# Altium schematic sheet MainBoard.SchDoc
size A3; SheetNumber: 7; SheetTotal: 11
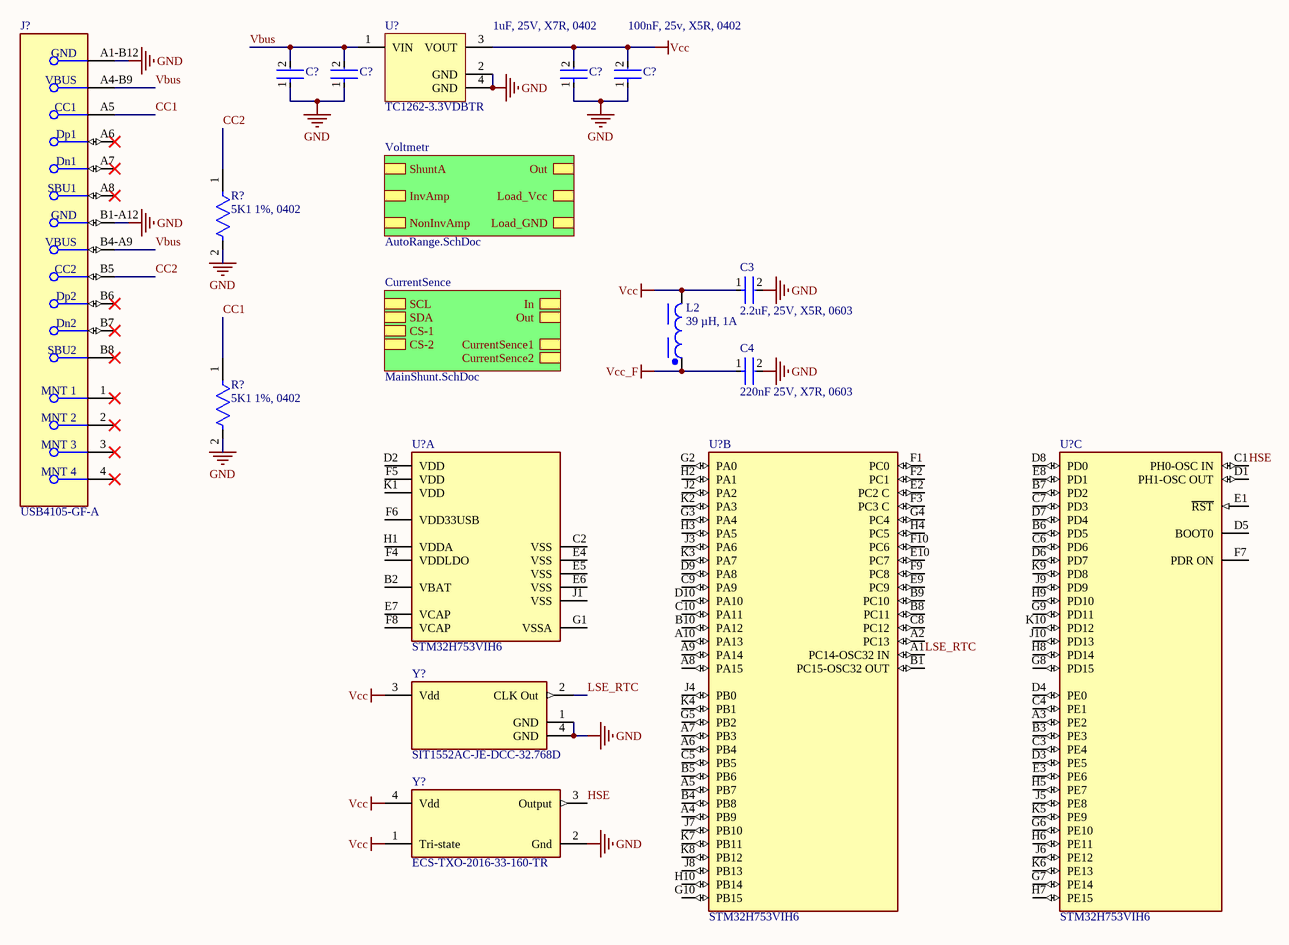
[diagram p0: MainBoard.SchDoc]

## Parts
(Parts that share a designator on the sheet are numbered #1, #2 ... from top to bottom, then left to right.)
C3  2.2uF, 25V, X5R, 0603  [FP-GRM188-0_1-e0_2_0_5-MFG]
C4  220nF 25V, X7R, 0603  [FP-GCM188-0_1-IPC_B]
C?#1  1uF, 25V, X7R, 0402  [FP-GRM155-0_05-IPC_B]  (value not drawn)
C?#2  100nF, 25v, X5R, 0402  [FP-GRM155-0_05-IPC_C]  (value not drawn)
C?#3  100nF, 25v, X5R, 0402  [FP-GRM155-0_05-IPC_C]  (value not drawn)
C?#4  1uF, 25V, X7R, 0402  [FP-GRM155-0_05-IPC_B]  (value not drawn)
J?  USB4105-GF-A  [FP-USB4105-GF-A-MFG]
L2  39 µH, 1A  [WE-PD_7345]
R?#1  5K1 1%, 0402  [FP-ERJ2RK-IPC_A]
R?#2  5K1 1%, 0402  [FP-ERJ2RK-IPC_A]
U?#1  TC1262-3.3VDBTR  [SOT-223-DB3_M]
U?#2  STM32H753VIH6  [FP-TFBGA100-A08Q-MFG]  (part A of 3)
U?#3  STM32H753VIH6  [FP-TFBGA100-A08Q-MFG]  (part B of 3)
U?#4  STM32H753VIH6  [FP-TFBGA100-A08Q-MFG]  (part C of 3)
Y?#1  SIT1552AC-JE-DCC-32.768D  [FP-SiT1552-J-MFG]
Y?#2  ECS-TXO-2016-33-160-TR  [FP-TXO-2016-MFG]

## Sub-sheets
CurrentSence = MainShunt.SchDoc: CurrentSence1, CurrentSence2, CS-1, CS-2, SDA, SCL, In, Out
Voltmetr = AutoRange.SchDoc: InvAmp, NonInvAmp, Load_GND, Load_Vcc, ShuntA, Out

## Nets
GND: C3.2 C4.2 C?#1.1 C?#2.1 C?#3.1 C?#4.1 J?.A1-B12(GND) J?.B1-A12(GND) R?#1.2 R?#2.2 U?#1.2(GND) U?#1.4(GND) Y?#1.1(GND) Y?#1.4(GND) Y?#2.2(Gnd)
Vcc: C3.1 C?#3.2 C?#4.2 L2.2 U?#1.3(VOUT) Y?#1.3(Vdd) Y?#2.1(Tri-state) Y?#2.4(Vdd)
Vcc_F: C4.1 L2.1
CC1: J?.A5(CC1) R?#2.1
CC2: J?.B5(CC2) R?#1.1
HSE: U?#4.C1(PH0-OSC_IN) Y?#2.3(Output)
LSE_RTC: U?#3.A1(PC14-OSC32_IN) Y?#1.2(CLK_Out)
Vbus: C?#1.2 C?#2.2 J?.A4-B9(VBUS) J?.B4-A9(VBUS) U?#1.1(VIN)

Not connected (* = marked no-connect by the designer): J? 1(MNT_1)* 2(MNT_2)* 3(MNT_3)* 4(MNT_4)* A6(Dp1)* A7(Dn1)* A8(SBU1)* B6(Dp2)* B7(Dn2)* B8(SBU2)*; U?#2 B2(VBAT) C2(VSS) D2(VDD) E4(VSS) E5(VSS) E6(VSS) E7(VCAP) F4(VDDLDO) F5(VDD) F6(VDD33USB) F8(VCAP) G1(VSSA) H1(VDDA) J1(VSS) K1(VDD); U?#3 A2(PC13) A4(PB9) A5(PB7) A6(PB4) A7(PB3) A8(PA15) A9(PA14) A10(PA13) B1(PC15-OSC32_OUT) B4(PB8) B5(PB6) B8(PC11) B9(PC10) B10(PA12) C5(PB5) C8(PC12) C9(PA9) C10(PA11) D9(PA8) D10(PA10) E2(PC2_C) E9(PC9) E10(PC7) F1(PC0) F2(PC1) F3(PC3_C) F9(PC8) F10(PC6) G2(PA0) G3(PA4) G4(PC4) G5(PB2) G10(PB15) H2(PA1) H3(PA5) H4(PC5) H10(PB14) J2(PA2) J3(PA6) J4(PB0) J7(PB10) J8(PB13) K2(PA3) K3(PA7) K4(PB1) K7(PB11) K8(PB12); U?#4 A3(PE2) B3(PE3) B6(PD5) B7(PD2) C3(PE4) C4(PE1) C6(PD6) C7(PD3) D1(PH1-OSC_OUT) D3(PE5) D4(PE0) D5(BOOT0) D6(PD7) D7(PD4) D8(PD0) E1(~{RST}) E3(PE6) E8(PD1) F7(PDR_ON) G6(PE10) G7(PE14) G8(PD15) G9(PD11) H5(PE7) H6(PE11) H7(PE15) H8(PD14) H9(PD10) J5(PE8) J6(PE12) J9(PD9) J10(PD13) K5(PE9) K6(PE13) K9(PD8) K10(PD12)

## Notes on the sheet
- 1uF, 25V, X7R, 0402
- (near C?#4) 100nF, 25v, X5R, 0402

## Library data of the parts
C3 = CMP-2006-02820-2: Chip Multilayer Ceramic Capacitors for General Purpose, 0603, 2.2uF, X5R, 15%, 10%, 25V; Number of Pins: 2; Dielectric: X5R; Tolerance: 10%; Case Code (Imperial): 0603; Thickness: 0.035inch; Case/Package: 0603; Lead Free: Lead Free; Mount: Surface Mount; Material: Ceramic; Depth: 0.8mm; Voltage: 25V; Capacitance: 2.2uF; Min Operating Temperature: -55°C; Package Quantity: 4000; REACH SVHC: No SVHC; Resistor Type: Ceramic; Packaging: Tape and Reel; Case Code (Metric): 1608; Max Operating Temperature: 85°C; Width: 0.8mm; Termination: SMD/SMT; Voltage Rating: 25V; Length: 1.6mm; Voltage Rating (DC): 25V; Height: 0.8mm; Radiation Hardening: No; Weight: 0.000222oz
C4 = CMP-2006-02366-2: Ceramic Capacitor for Automotive 220nF  ±10% 25VDC X7R 0603 Paper T/R; Capacitance: 220nF; Mount: Surface Mount; Ratings: AEC-Q200; Case/Package: 0603; Packaging: Tape and Reel; Radiation Hardening: No; Voltage: 25V; Dielectric: X7R; Case Code (Imperial): 0603; Max Operating Temperature: 125°C; Min Operating Temperature: -55°C; Depth: 0.8mm; Termination: SMD/SMT; Package Quantity: 1; Case Code (Metric): 1608; Thickness: 0.035inch; Voltage Rating: 25V; Tolerance: 10%; Voltage Rating (DC): 25V; Height: 0.8mm; Lead Free: Lead Free; Length: 1.6mm; Width: 0.031inch
C?#1 C?#4 = CMP-2008-04581-2: Chip Multilayer Ceramic Capacitors for General Purpose, 0402, 1.0uF, X5R, 15%, 10%, 25V; Height: 0.5mm; Voltage: 25V; Tolerance: 10%; Termination: SMD/SMT; Dielectric: X5R; REACH SVHC: No SVHC; Case Code (Imperial): 0402; Max Operating Temperature: 85°C; Lead Free: Lead Free; Case/Package: 0402; Mount: Surface Mount; Width: 0.5mm; Weight: 0.000212oz; Min Operating Temperature: -55°C; Voltage Rating (DC): 25V; Length: 1mm; Thickness: 0.022inch; Voltage Rating: 25V; Material: Ceramic; Case Code (Metric): 1005; Package Quantity: 10000; Packaging: Tape and Reel; Depth: 0.5mm; Capacitance: 1uF
C?#2 C?#3 = CMP-06035-003661-1: Chip Multilayer Ceramic Capacitors for General Purpose, 0402, 0.10uF, X7R, 15%, 10%, 25V; Length: 1mm; Depth: 0.5mm; Dielectric: X7R; Voltage Rating: 25V; Lead Free: Lead Free; Case Code (Imperial): 0402; Voltage: 25V; Min Operating Temperature: -55°C; Tolerance: 10%; Dielectric Material: Ceramic; Voltage Rating (DC): 25V; Max Operating Temperature: 125°C; Capacitance: 100nF; Thickness: 0.022inch; Case/Package: 0402; Height: 0.5mm; Resistor Type: Ceramic; Weight: 0.000212oz; Case Code (Metric): 1005; Package Quantity: 10000; Termination: SMD/SMT; Width: 0.02inch; Mount: Surface Mount; Packaging: Tape and Reel
J? = CMP-245163-000001-1: CONN RCPT USB2.0 TYPEC 5A; Manufacturer: GCT; Voltage Rating: 20V; Is Female: yes; Current Rating: 5/6.25/1.25/0.25A; Number Of Contacts: 16; Conn Orientation: Right Angle; Device Class L1: Connectors; Category: Conn; Lead Free: Yes; RoHS: TRUE; Temperature Range High: +85°C; Digikey Description: CONN RCPT USB2.0 TYPEC 5A; Device Class L3: unset; ComponentLink2Description: Datasheet; Manufacturer Part Number: USB4105-GF-A; Package: 0; Usb Standard: USB 2.0; Device Class L2: USB Connectors; Automotive: No; Temperature Range Low: -40°C; Height: 3.46mm; Temperature: -40°C to +85°C; Contact Material: Gold,Nickel; ComponentLink2URL: https://gct.co/files/drawings/usb4105.pdf; Octopart: https://octopart.com/usb4105-gf-a-gct-106627878
L2 = CMP-0227-00153-2: NexarPartId: 29930417; Max DC Current: 1.11A; Shielding: Shielded; Inductance: 39µH; Self Resonant Frequency: 11MHz; DC Resistance (DCR): 145mΩ; Tolerance: 20%; Ambient Temperature Range Low: -40°C; Width: 7.3mm; Length: 7.3mm; Number of Pins: 2; Packaging: Tape & Reel; Height: 4.5mm; Ambient Temperature Range High: 85°C; Max Operating Temperature: 125°C; Depth: 7.3mm; Min Operating Temperature: -40°C; RoHS: Compliant; Current Rating: 1.11A
R?#1 R?#2 = CMP-2002-01158-2: RES SMD 5.1K OHM 1% 1/10W 0402; Voltage Rating: 50V; Temperature Coefficient: 100ppm/°C; Resistance: 5.1kR; Power Rating: 100mW; Min Operating Temperature: -55°C; Technology: THICK FILM; Military Standard: Not; Depth: 0.5mm; Contact Plating: Tin; Tolerance: 1%; Construction: Rectangular; Length: 1mm; Case/Package: 0402; Lead Free: Lead Free; RoHS Compliant: Yes; Termination: SMD/SMT; Height: 0.35mm; Max Operating Temperature: 155°C; Case Code (Imperial): 0402; Number of Terminations: 2; Packaging: Tape and Reel; Case Code (Metric): 1005; Width: 0.5mm; Max Power Dissipation: 100mW; Package Quantity: 10000; Resistance Tolerance: 1%; REACH SVHC: No SVHC; Mount: Surface Mount; Series: ERJ; Voltage Rating (DC): 50V; Weight: 2.8E-05oz; Resistor Type: Thick Film
U?#1 = CMP-0136-00481-1: 500mA Fixed Output CMOS LDO, 3-Pin SOT-223, Extended Temperature, Tape and Reel; PackageVersion: revBB, Aug-2009; PackageDescription: 3-Lead Plastic Small Outline Transistor (DB) [SOT-223]; DatasheetVersion: revB, 2002; PackageReference: SOT-223-DB3
U?#2-U?#4 = CMP-12105-000002-1: HIGH-PERFORMANCE AND DSP WITH DP; Manufacturer: STMicroelectronics; Number Of Timers/Counters: 20; Min Supply Voltage: 1.71V; Standoff Height: 0.15mm; Number Of I/Os: 82; Data Bus Width: 32bits; Interface: I2C,SPI,UART,USART,CAN,USB,Ethernet,I2S,SMBus,Other; Description: ARM® Cortex®-M7 STM32H7 Microcontroller IC 32-Bit 480MHz 2MB (2M x 8) FLASH 100-TFBGA (8x8); Memory Size: 2MBytes; Core Architecture: ARM Cortex-M7; Frequency: 480MHz; Number Of Spi Channels: 6; Memory Type: FLASH; Max Junction Temp: +125°C; Number Of Pwm Channels: 2; Nominal Supply Current: 70-165uA; Number Of A/D Converters: 3; Ram Size: 1MBytes; Number Of I2C Channels: 4; Number Of Adc Channels: 36; Max Supply Voltage: 3.6V; Number Of Cores: 1; Number Of Uart Channels: 9; Automotive: No; Lead Free: Yes; Device Class L3: Microcontrollers; ComponentLink2URL: https://www.st.com/resource/en/datasheet/stm32h753ai.pdf; Temperature: -40°C to +85°C; Device Class L1: Integrated Circuits (ICs); Digikey Description: HIGH-PERFORMANCE AND DSP WITH DP; Ipc Land Pattern Name: BGA100C80P10X10_800X800X110; ComponentLink2Description: Datasheet; Ambient Temperature Range Low: -40°C; Category: IC; Height: 1.1mm; Temperature Range High: +85°C; Ambient Temperature Range High: +85°C; Temperature Range Low: -40°C; Number Of Usb Channels: 2; Manufacturer Part Number: STM32H753VIH6; Octopart: https://octopart.com/stm32h753vih6-stmicroelectronics-93180202; Package: TFBGA100-A08Q; Number Of Ethernet Channels: 1; Device Class L2: Embedded Processors and Controllers; RoHS: TRUE
Y?#1 = CMP-25159-260295-1: MEMS OSC TCXO 32.7680KHZ LVCMOS; Frequency Stability: 5ppm; Frequency: 32.768kHz; Min Operating Temperature: 0°C; Length: 0.061inch; Mount: Surface Mount; Max Operating Temperature: 70°C; Width: 0.033inch; RoHS Compliant: Yes; Series: SiT1552; Packaging: Cut Tape; Height: 0.024inch
Y?#2 = CMP-40224-000008-1: XTAL OSC TCXO 16MHZ 3.3V SMD; Manufacturer: ECS; Max Supply Voltage: 3.63V; Max Supply Current: 7mA; Stability: 2ppm; Min Supply Voltage: 2.97V; Description: 16MHz TCXO HCMOS Oscillator 3.3V Enable/Disable 4-SMD, No Lead; Load Capacitance: 15pF; Frequency: 16MHz; Device Class L1: Passive Components; Manufacturer Part Number: ECS-TXO-2016-33-160-TR; Digikey Description: XTAL OSC TCXO 16MHZ 3.3V SMD; Device Class L3: Oscillators; Category: Crys; Lead Free: Yes; Temperature: -40°C to +85°C; RoHS: TRUE; ComponentLink2Description: Datasheet; Octopart: https://octopart.com/ecs-txo-2016-33-160-tr-ecs+international-102811109; ComponentLink2URL: https://ecsxtal.com/store/pdf/ECS-TXO-2016.pdf; Temperature Range High: +85°C; Height: 0.8mm; Device Class L2: Crystals / Oscillators; Package: TXO-2016; Temperature Range Low: -40°C; Series: TXO-2016; Automotive: No